# EAGLE schematic GS_IIM_RFINAL_R_4 (EAGLE 7.2.0)
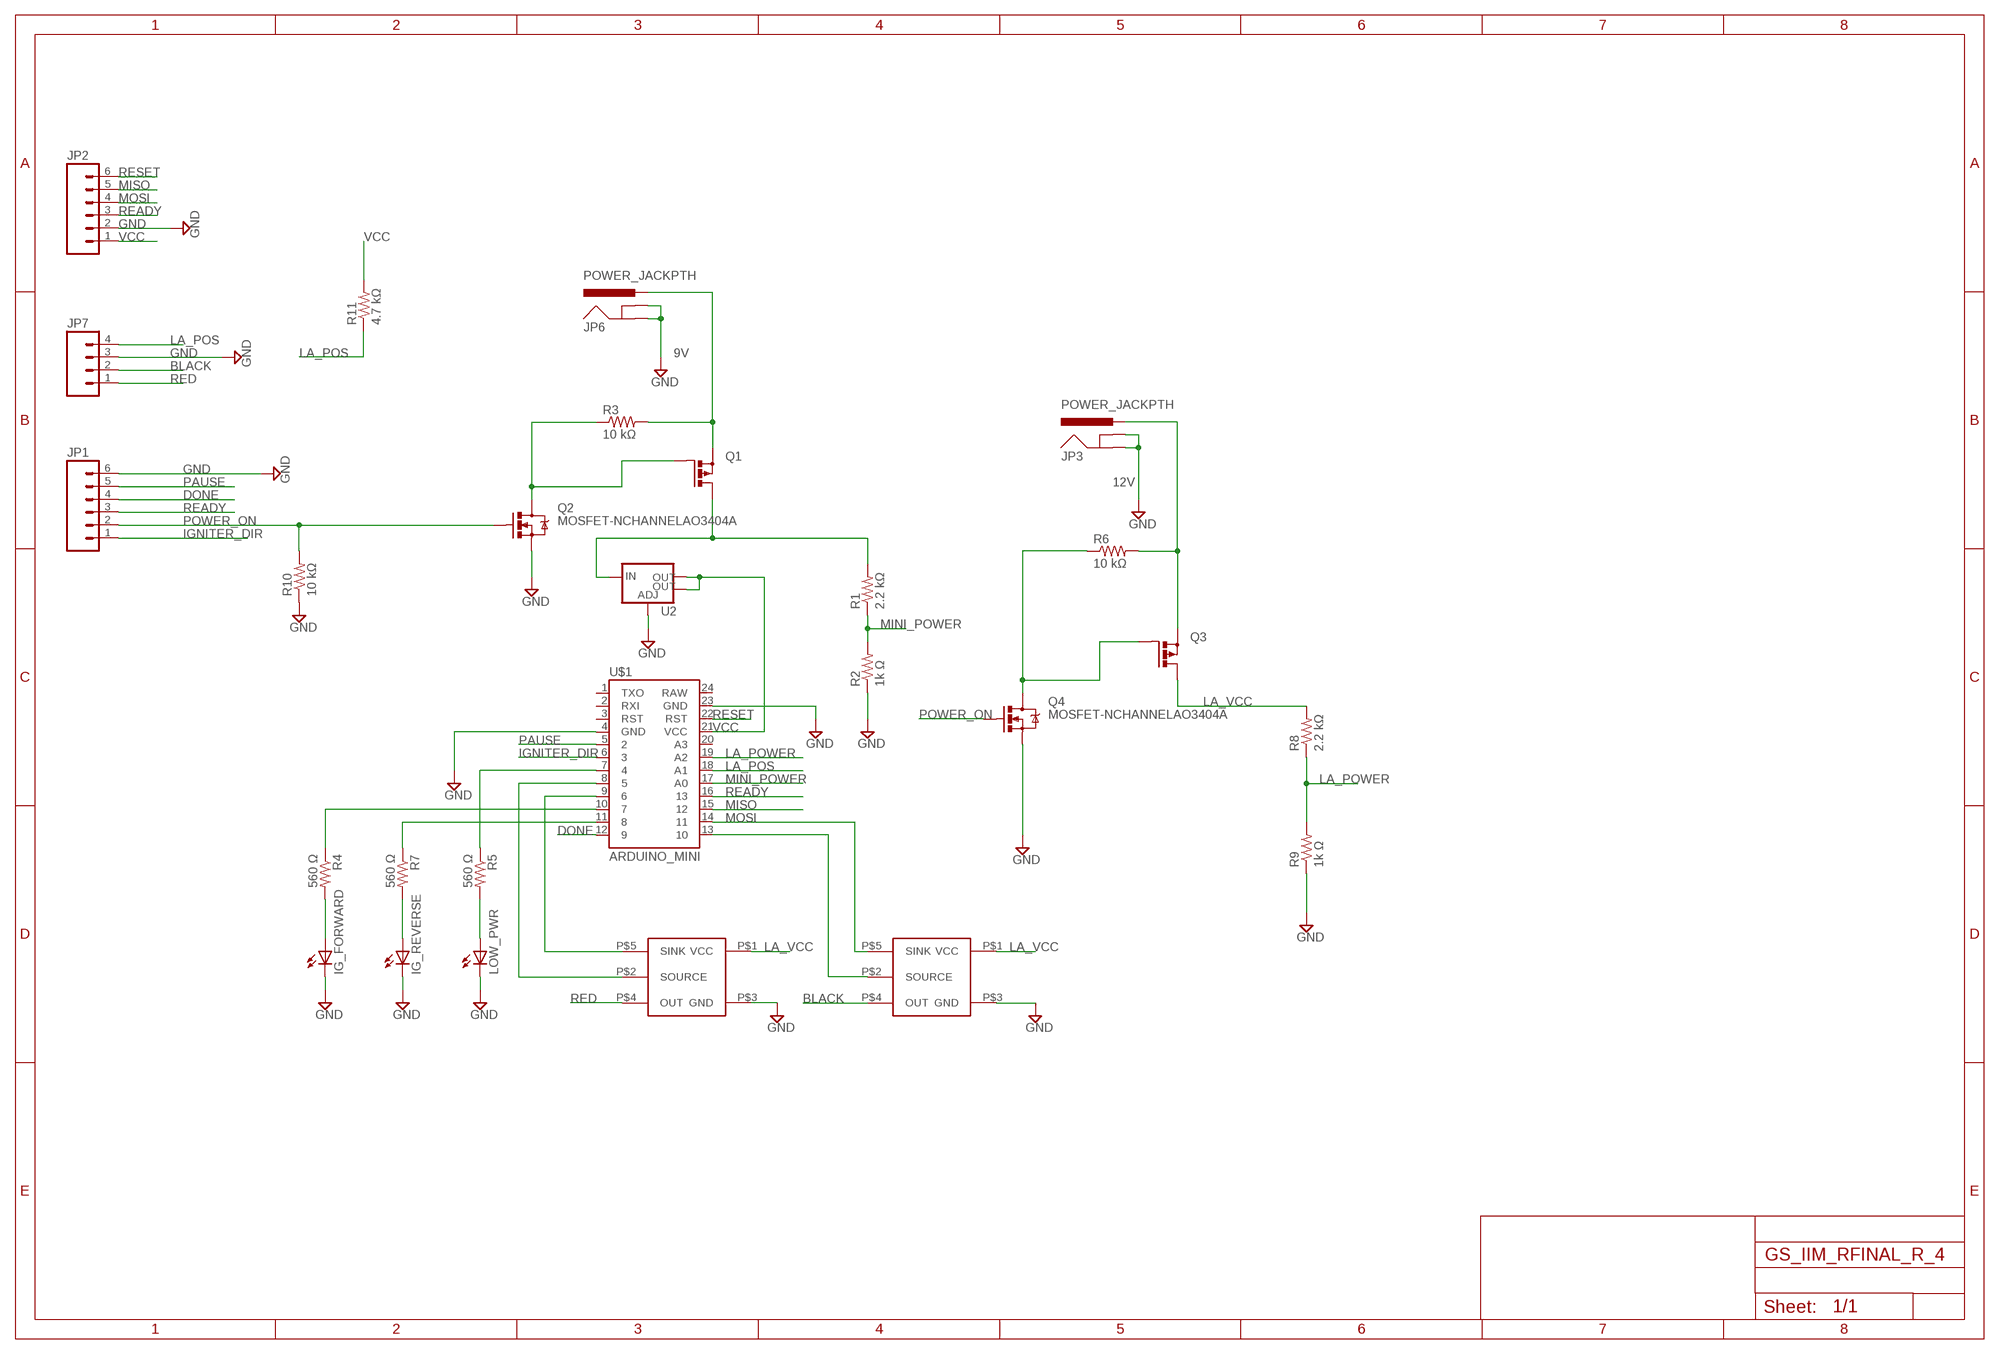
[diagram p0: schematic, sheet 1]

## Parts
IG_FORWARD  LED5MM  [LED5MM]
IG_REVERSE  LED5MM  [LED5MM]
JP1  M06SILK_FEMALE_PTH  [1X06]
JP2  M06SILK_FEMALE_PTH  [1X06]
JP3  POWER_JACKPTH  [POWER_JACK_PTH]
JP6  POWER_JACKPTH  [POWER_JACK_PTH]
JP7  M04PTH  [1X04]
LOW_PWR  LED5MM  [LED5MM]
Q1  P-MOSFET-SO8  [SO-08]
Q2  MOSFET-NCHANNELAO3404A  [SOT23-3]
Q3  P-MOSFET-SO8  [SO-08]
Q4  MOSFET-NCHANNELAO3404A  [SOT23-3]
R1  2.2 kΩ  RESISTOR1206  [1206]
R2  1k Ω  RESISTOR1206  [1206]
R3  10 kΩ  RESISTOR1206  [1206]
R4  560 Ω  RESISTOR1206  [1206]
R5  560 Ω  RESISTOR1206  [1206]
R6  10 kΩ  RESISTOR1206  [1206]
R7  560 Ω  RESISTOR1206  [1206]
R8  2.2 kΩ  RESISTOR1206  [1206]
R9  1k Ω  RESISTOR1206  [1206]
R10  10 kΩ  RESISTOR1206  [1206]
R11  4.7 kΩ  RESISTOR1206  [1206]
U2  V_REG_LM1117SOT223  [SOT223]
U$1  ARDUINO_MINI  [ARDUINO_MINI]
U$3  UC2950  [TO-220]
UC2950_1  UC2950  [TO-220]

## Nets
9V: JP6.PWR Q1.1(S) Q1.2(S) Q1.3(S) R3.2
12V: JP3.PWR Q3.1(S) Q3.2(S) Q3.3(S) R6.2
BLACK: JP7.2 U$3.P$4(OUT)
DONE: JP1.4 U$1.12
GND: IG_FORWARD.K(C) IG_REVERSE.K(C) JP1.6 JP2.2 JP3.GND JP3.GNDBREAK JP6.GND JP6.GNDBREAK JP7.3 LOW_PWR.K(C) Q2.2(S) Q4.2(S) R2.1 R9.1 R10.1 U2.1(ADJ) U$1.4(GND) U$1.23(GND) U$3.P$3(GND) UC2950_1.P$3(GND)
IGNITER_DIR: JP1.1 U$1.6
LA_POS: JP7.4 R11.1 U$1.18(A1)
LA_POWER: R8.1 R9.2 U$1.19(A2)
LA_VCC: Q3.5(D) Q3.6(D) Q3.7(D) Q3.8(D) R8.2 U$3.P$1(VCC) UC2950_1.P$1(VCC)
MINI_POWER: R1.1 R2.2 U$1.17(A0)
MISO: JP2.5 U$1.15
MOSI: JP2.4 U$1.14 U$3.P$5(SINK)
N$1: R5.1 U$1.7
N$4: IG_REVERSE.A R7.2
N$5: LOW_PWR.A R5.2
N$6: IG_FORWARD.A R4.2
N$8: Q1.4(G) Q2.3(D) R3.1
N$11: R7.1 U$1.11
N$12: U$1.8 UC2950_1.P$2(SOURCE)
N$13: U$1.9 UC2950_1.P$5(SINK)
N$15: R4.1 U$1.10
N$17: Q3.4(G) Q4.3(D) R6.1
N$18: U$1.13 U$3.P$2(SOURCE)
N$19: Q1.5(D) Q1.6(D) Q1.7(D) Q1.8(D) R1.2 U2.3(IN)
PAUSE: JP1.5 U$1.5
POWER_ON: JP1.2 Q2.1(G) Q4.1(G) R10.2
READY: JP1.3 JP2.3 U$1.16
RED: JP7.1 UC2950_1.P$4(OUT)
RESET: JP2.6 U$1.22(RST)
VCC: JP2.1 R11.2 U2.2(OUT) U2.4(OUT) U$1.21(VCC)
Unconnected: U$1.1(TXO) U$1.2(RXI) U$1.3(RST) U$1.20(A3) U$1.24(RAW)

## Library data of the parts
IG_FORWARD IG_REVERSE LOW_PWR = led:LED: LED OSRAM: - CHIPLED LG R971, LG N971, LY N971, LG Q971, LY Q971, LO R971, LY R971 LH N974, LH R974 LS Q976, LO Q976, LY Q976 LO Q996 - Hyper CHIPLED LW Q18S LB Q993, LB Q99A, LB R99A - SideLED LS A670, LO A670, LY A670, LG A670, LP A670 LB A673, LV A673, LT A673, LW A673 LH A674 LY A675 LS A676, LA A676, LO A676, LY A676, LW A676 LS A679, LY A679, LG A679 - Hyper Micro SIDELED® LS Y876, LA Y876, LO Y876, LY Y876 LT Y87S - SmartLED LW L88C, LW L88S LB L89C, LB L89S, LG L890 LS L89K, LO L89K, LY L89K LS L896, LA L896, LO L896, LY L896 - TOPLED LS T670, LO T670, LY T670, LG T670, LP T670 LSG T670, LSP T670, LSY T670, LOP T670, LYG T670 LG T671, LOG T671, LSG T671 LB T673, LV T673, LT T673, LW T673 LH T674 LS T676, LA T676, LO T676, LY T676, LB T676, LH T676, LSB T676, LW T676 LB T67C, LV T67C, LT T67C, LS T67K, LO T67K, LY T67K, LW E67C LS E67B, LA E67B, LO E67B, LY E67B, LB E67C, LV E67C, LT E67C LW T67C LS T679, LY T679, LG T679 LS T770, LO T770, LY T770, LG T770, LP T770 LB T773, LV T773, LT T773, LW T773 LH T774 LS E675, LA E675, LY E675, LS T675 LS T776, LA T776, LO T776, LY T776, LB T776 LHGB T686 LT T68C, LB T68C - Hyper Mini TOPLED® LB M676 - Mini TOPLED Santana® LG M470 LS M47K, LO M47K, LY M47K Source: http://www.osram.convergy.de LUXEON: - LUMILED® LXK2-PW12-R00, LXK2-PW12-S00, LXK2-PW14-U00, LXK2-PW14-V00 LXK2-PM12-R00, LXK2-PM12-S00, LXK2-PM14-U00 LXK2-PE12-Q00, LXK2-PE12-R00, LXK2-PE12-S00, LXK2-PE14-T00, LXK2-PE14-U00 LXK2-PB12-K00, LXK2-PB12-L00, LXK2-PB12-M00, LXK2-PB14-N00, LXK2-PB14-P00, LXK2-PB14-Q00 LXK2-PR12-L00, LXK2-PR12-M00, LXK2-PR14-Q00, LXK2-PR14-R00 LXK2-PD12-Q00, LXK2-PD12-R00, LXK2-PD12-S00 LXK2-PH12-R00, LXK2-PH12-S00 LXK2-PL12-P00, LXK2-PL12-Q00, LXK2-PL12-R00 Source: www.luxeon.com KINGBRIGHT: KA-3528ASYC Source: www.kingbright.com
JP1 JP2 = SparkFun-Connectors:M06: Header 6 Standard 6-pin 0.1" header. Use with straight break away headers (SKU : PRT-00116), right angle break away headers (PRT-00553), swiss pins (PRT-00743), machine pins (PRT-00117), and female headers (PRT-00115). Molex polarized connector foot print use with SKU : PRT-08094 with associated crimp pins and housings. NOTES ON THE VARIANTS LOCK and LOCK_LONGPADS... This footprint was designed to help hold the alignment of a through-hole component (i.e. 6-pin header) while soldering it into place. You may notice that each hole has been shifted either up or down by 0.005 of an inch from it's more standard position (which is a perfectly straight line). This slight alteration caused the pins (the squares in the middle) to touch the edges of the holes. Because they are alternating, it causes a "brace" to hold the component in place. 0.005 has proven to be the perfect amount of "off-center" position when using our standard breakaway headers. Although looks a little odd when you look at the bare footprint, once you have a header in there, the alteration is very hard to notice. Also,if you push a header all the way into place, it is covered up entirely on the bottom side. This idea of altering the position of holes to aid alignment will be further integrated into the Sparkfun Library for other footprints. It can help hold any component with 3 or more connection pins.; PROD_ID: CONN-08437
JP3 JP6 = SparkFun-Connectors:POWER_JACK: Power Jack This is the standard 5.5mm barrel jack for power. The PTH is the most common, proven, reliable, footprint. The Slot footprint only works if the mill layer is transmitted to the PCB fab house so be warned. Mating wall wart : TOL-00298 (and others); PROD_ID: CONN-08197
JP7 = SparkFun-Connectors:M04: Header 4 Standard 4-pin 0.1" header. Use with straight break away headers (SKU : PRT-00116), right angle break away headers (PRT-00553), swiss pins (PRT-00743), machine pins (PRT-00117), and female headers (PRT-00115). Molex polarized connector foot print use with SKU : PRT-08231 with associated crimp pins and housings. 1MM SMD Version SKU: PRT-10208
Q1 Q3 = transistor-power:P-MOSFET-SO8: P-Channel MOSFET Example: FDS4435A; P-Channel Logic Level PowerTrench® MOSFET FDS4465; P-Channel 1.8V Specified PowerTrench® MOSFET Source: www.fairchildsemi.com
Q2 Q4 = SparkFun-DiscreteSemi:MOSFET-NCHANNEL: Common NMOSFET Parts MFG P/N Store ID Prod ID FDD8780 TRANS-09984 SI7820DN TRANS-11055 FDS6630A IC-08089 2N7002PW TRANS-11151 FQP30N06L COM-10213 TRANS-10060 BSS123LT1G TRANS-08345 BSS138 TRANS-00830 BS170 2N7000; PROD_ID: TRAN-12988
R1-R11 = SparkFun-Passives:RESISTOR: Resistor Basic schematic elements and footprints for 0603, 1206, and PTH resistors.
U2 = SparkFun-PowerIC:V_REG_LM1117: Voltage Regulator LM1117 Standard adjustable voltage regulator but in SMD form. Spark Fun Electronics SKU : COM-00595; PROD_ID: VREG-08170
U$1 = SparkFun-Boards:ARDUINO_MINI: Arduino Pro Mini footprint
U$3 UC2950_1 = UC2950:UC2950